# Altium schematic sheet 5APOWER.SchDoc
size A4
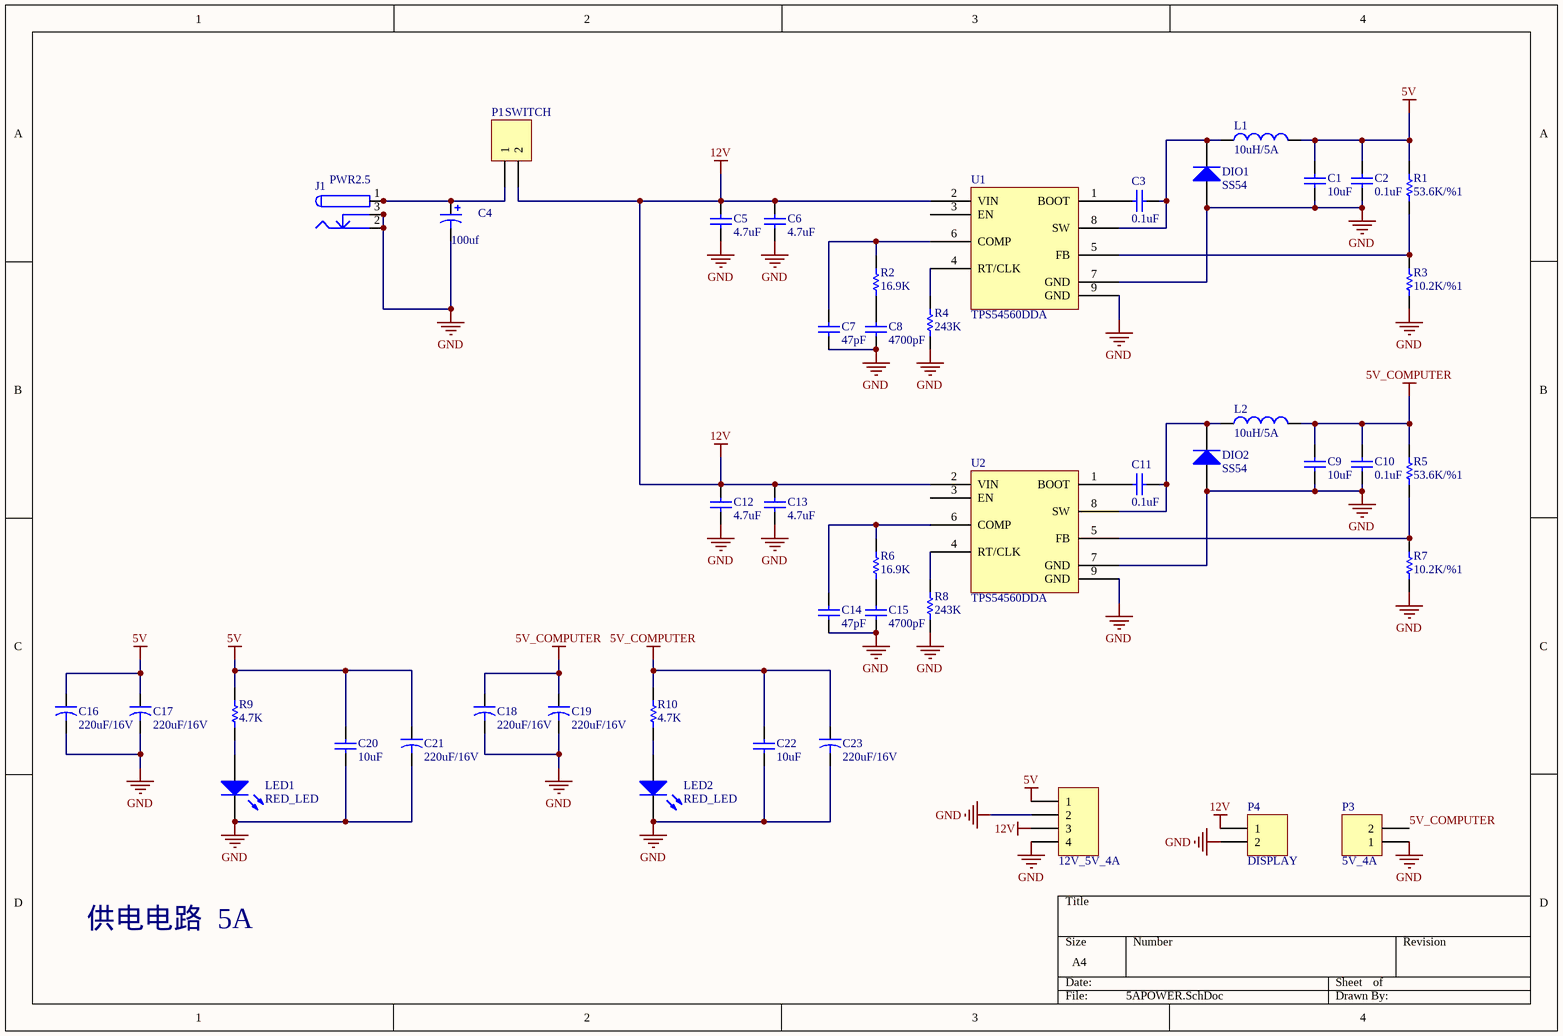
[diagram p0: 5APOWER.SchDoc]

## Parts
C1  10uF  [0805C]
C2  0.1uF  [0805C]
C3  0.1uF  [0805C]
C4  100uf  [S-C6.6-H7.2]
C5  4.7uF  [0805C]
C6  4.7uF  [0805C]
C7  47pF  [0805C]
C8  4700pF  [0805C]
C9  10uF  [0805C]
C10  0.1uF  [0805C]
C11  0.1uF  [0805C]
C12  4.7uF  [0805C]
C13  4.7uF  [0805C]
C14  47pF  [0805C]
C15  4700pF  [0805C]
C16  220uF/16V  [S-C6.6-H7.2]
C17  220uF/16V  [S-C6.6-H7.2]
C18  220uF/16V  [S-C6.6-H7.2]
C19  220uF/16V  [S-C6.6-H7.2]
C20  10uF  [0805C]
C21  220uF/16V  [S-C6.6-H7.2]
C22  10uF  [0805C]
C23  220uF/16V  [S-C6.6-H7.2]
DIO1  SS54  [SMB-B]
DIO2  SS54  [SMB-B]
J1  PWR2.5  [DC10B]
L1  10uH/5A  [L-7X7S]
L2  10uH/5A  [L-7X7S]
LED1  RED_LED  [0805D]
LED2  RED_LED  [0805D]
P1  SWITCH  [2.54-2P]
P2  12V_5V_4A  [2.54-4p]
P3  5V_4A  [2.54-2P]
P4  DISPLAY  [2.54-2P]
R1  53.6K/%1  [0805_RES]
R2  16.9K  [0805_RES]
R3  10.2K/%1  [0805_RES]
R4  243K  [0805_RES]
R5  53.6K/%1  [0805_RES]
R6  16.9K  [0805_RES]
R7  10.2K/%1  [0805_RES]
R8  243K  [0805_RES]
R9  4.7K  [0805_RES]
R10  4.7K  [0805_RES]
U1  TPS54560DDA  [SO08]
U2  TPS54560DDA  [SO08]

## Nets
5V: C1.2 C2.2 C16.A C17.A C20.2 C21.A L1.2 P2.1 R1.1 R9.1
5V_COMPUTER: C9.2 C10.2 C18.A C19.A C22.2 C23.A L2.2 P3.2 R5.1 R10.1
12V: C5.2 C6.2 C12.2 C13.2 P1.2 P2.3 P4.1 U1.2(VIN) U2.2(VIN)
GND: C1.1 C2.1 C4.K C5.1 C6.1 C7.1 C8.1 C9.1 C10.1 C12.1 C13.1 C14.1 C15.1 C16.K C17.K C18.K C19.K C20.1 C21.K C22.1 C23.K DIO1.A DIO2.A J1.2 J1.2A J1.2B J1.3 J1.3A J1.3B LED1.K LED2.K P2.2 P2.4 P3.1 P4.2 R3.2 R4.2 R7.2 R8.2 U1.7(GND) U1.9(GND) U2.7(GND) U2.9(GND)
NetC3_1: C3.1 DIO1.K L1.1 U1.8(SW)
NetC3_2: C3.2 U1.1(BOOT)
NetC4_A: C4.A J1.1 J1.1A J1.1B P1.1
NetC7_2: C7.2 R2.1 U1.6(COMP)
NetC8_2: C8.2 R2.2
NetC11_1: C11.1 DIO2.K L2.1 U2.8(SW)
NetC11_2: C11.2 U2.1(BOOT)
NetC14_2: C14.2 R6.1 U2.6(COMP)
NetC15_2: C15.2 R6.2
NetLED1_A: LED1.A R9.2
NetLED2_A: LED2.A R10.2
NetR1_2: R1.2 R3.1 U1.5(FB)
NetR4_1: R4.1 U1.4(RT/CLK)
NetR5_2: R5.2 R7.1 U2.5(FB)
NetR8_1: R8.1 U2.4(RT/CLK)

Not connected (* = marked no-connect by the designer): U1 3(EN); U2 3(EN)

## Notes on the sheet
- 供电电路  5A

## Library data of the parts
C1-C3 C5-C15 C20 C22 = CAP
C4 = Cap Pol1: Polarized Capacitor (Radial); Published: 8-Jun-2000; LatestRevisionDate: 17-Jul-2002; LatestRevisionNote: Re-released for DXP Platform.; PackageReference: RB7.6-15; Publisher: Altium Limited; PackageDescription: Polarized Capacitor (Radial); 2 Leads
C16-C19 C21 C23 = CAP-SOP: 铝电解电容
DIO1 DIO2 = IN5822
J1 = PWR2.5: Low Voltage Power Supply Connector; Published: 17-Dec-2003; DatasheetDocument: 09-May-2002; Publisher: Altium Limited; ComponentLink1Description: Manufacturer Link; ComponentLink1URL: http://domino.kycon.com/internet/Products.html
L1 L2 = L
LED1 LED2 = LED
P1 P3 P4 = Header 2: Header, 2-Pin; LatestRevisionDate: 17-Jul-2002; LatestRevisionNote: Re-released for DXP Platform.; Publisher: Altium Limited
P2 = Header 4: Header, 4-Pin; LatestRevisionDate: 17-Jul-2002; LatestRevisionNote: Re-released for DXP Platform.; Publisher: Altium Limited
R1 R3 R5 R7 = RES: 精密电阻
R2 R4 R6 R8-R10 = RES
U1 U2 = TPS54560DDA: 电源芯片